# Altium schematic sheet Motor Connections.SchDoc
size A
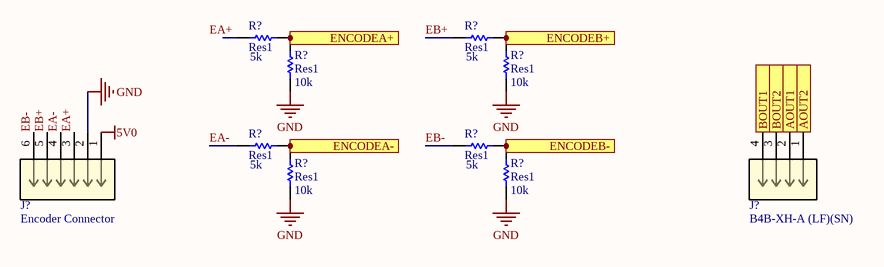
[diagram p0: Motor Connections.SchDoc]

## Parts
(Parts that share a designator on the sheet are numbered #1, #2 ... from top to bottom, then left to right.)
J?#1  Encoder Connector  [CONN_B6B-XH-A(LF)(SN)_JST]
J?#2  B4B-XH-A (LF)(SN)  [CONN_B4B-XH-A (LF)(SN)_JST]
R?#1  Res1  value 5k  [0402-A]
R?#2  Res1  value 10k  [0402-A]
R?#3  Res1  value 5k  [0402-A]
R?#4  Res1  value 10k  [0402-A]
R?#5  Res1  value 5k  [0402-A]
R?#6  Res1  value 10k  [0402-A]
R?#7  Res1  value 5k  [0402-A]
R?#8  Res1  value 10k  [0402-A]

## Ports
AOUT1 (in), AOUT2 (in), BOUT1 (in), BOUT2 (in), ENCODEA+ (out), ENCODEA- (out), ENCODEB+ (out), ENCODEB- (out)

## Nets
5V0: J?#1.1
GND: J?#1.2 R?#2.2 R?#4.2 R?#6.2 R?#8.2
AOUT1: J?#2.2 ; port AOUT1
AOUT2: J?#2.1 ; port AOUT2
BOUT1: J?#2.4 ; port BOUT1
BOUT2: J?#2.3 ; port BOUT2
EA+: J?#1.3
EA-: J?#1.4 R?#5.2
EB+: J?#1.5 R?#3.2
EB-: J?#1.6 R?#7.2
ENCODEA+: R?#1.1 R?#2.1 ; port ENCODEA+
ENCODEA-: R?#5.1 R?#6.1 ; port ENCODEA-
ENCODEB+: R?#3.1 R?#4.1 ; port ENCODEB+
ENCODEB-: R?#7.1 R?#8.1 ; port ENCODEB-

Not connected (* = marked no-connect by the designer): R?#1 2

## Notes on the sheet
- Labels drawn without touching a wire or pin: EA+

## Library data of the parts
J?#1 = B6B-XH-A(LF)(SN): No Description Available; Vendor: JST; Built_By: EMA_Cory; SourceLibrary: JST_2019-12-02; Manufacturer_Part_Number: B6B-XH-A(LF)(SN); Copyright: Copyright (C) 2018 Accelerated Designs. All rights reserved; RefDes: RefDes; Type: DEV
J?#2 = B4B-XH-A (LF)(SN): No Description Available; Vendor: JST; Built_By: EMA_Cory; SourceLibrary: JST_2020-02-03; Datasheet: http://www.jst-mfg.com/product/pdf/eng/eXH.pdf; Manufacturer_Part_Number: B4B-XH-A (LF)(SN); Copyright: Copyright (C) 2018 Accelerated Designs. All rights reserved; RefDes: RefDes; Type: DEV
R?#1-R?#8 = Res1: Resistor; Published: 8-Jun-2000; LatestRevisionDate: 17-Jul-2002; LatestRevisionNote: Re-released for DXP Platform.; PackageReference: AXIAL-0.3; Publisher: Altium Limited; PackageDescription: Axial Device, Thru-Hole; 2 Leads; 0.3 in Pin Spacing